# Altium schematic sheet Sheet2.SchDoc
size A4; SheetNumber: 1; SheetTotal: 1
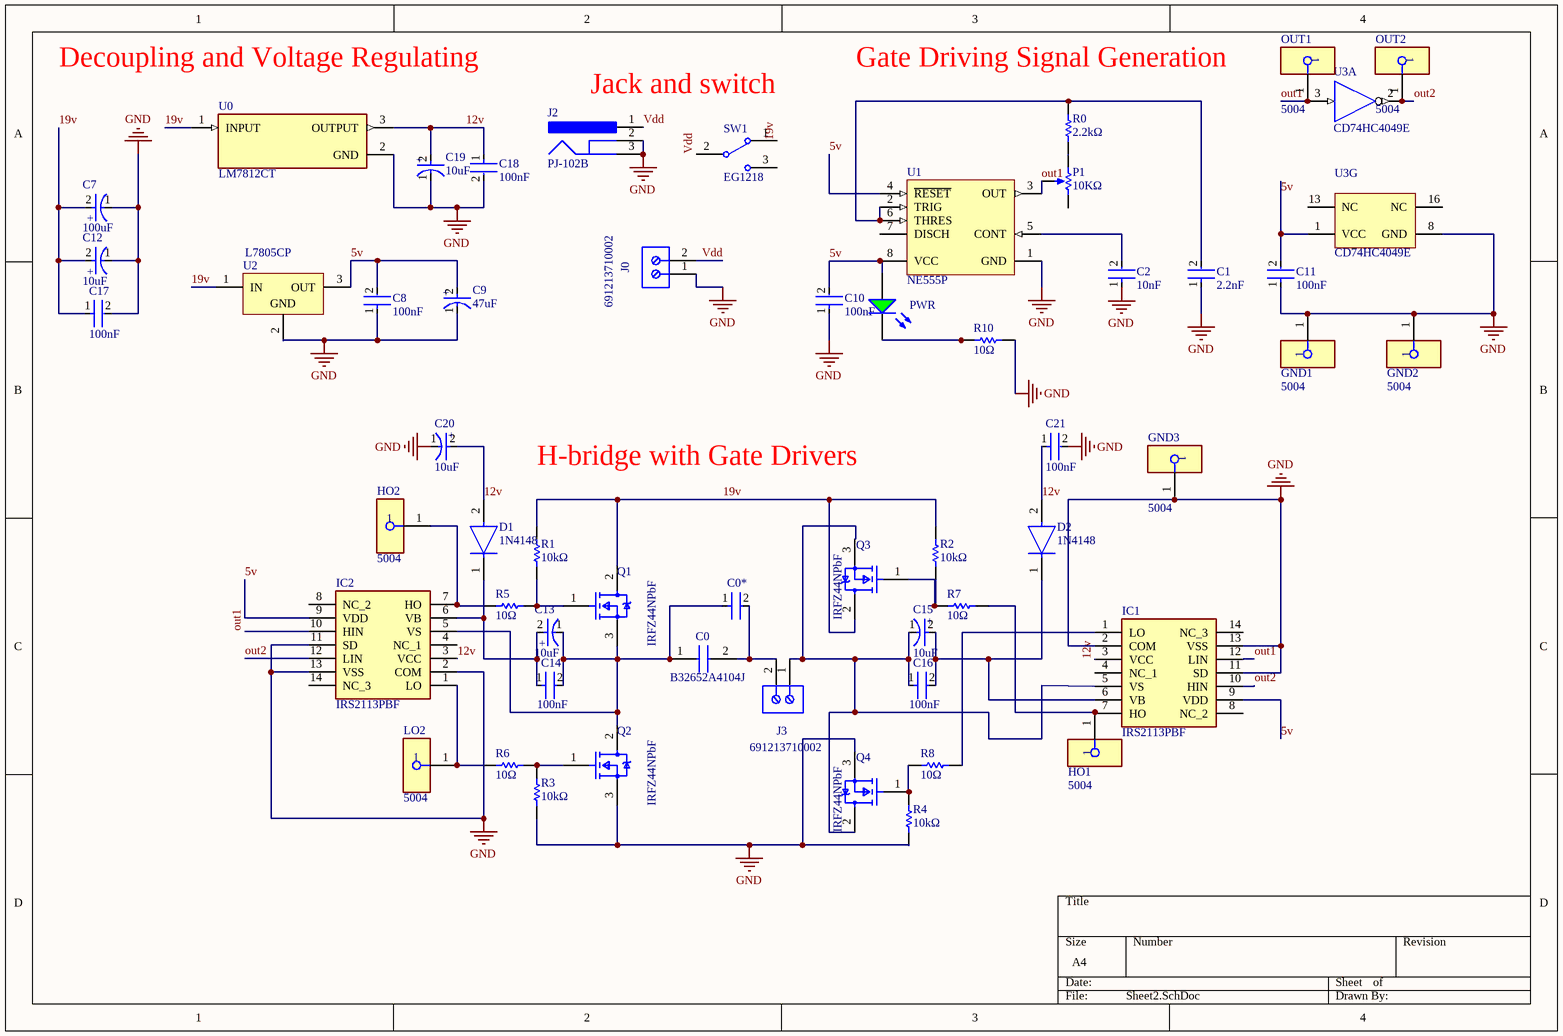
[diagram p0: Sheet2.SchDoc]

## Parts
C0  B32652A4104J  [B32652A4104J]
C0*  200nF  [FP-RDE2M1-MFG]  (value not drawn)
C1  2.2nF  [FP-RDE2M1-MFG]
C2  10nF  [FP-RDE2M1-MFG]
C7  100uF  [FP-RAD-TH-D_10_0_5-L_20_2-MFG]
C8  100nF  [FP-RDE2M1-MFG]
C9  47uF  [FP-RAD-TH-D_5_0_5-L_11_1-MFG]
C10  100nF  [FP-RDE2M1-MFG]
C11  100nF  [FP-RDE2M1-MFG]
C12  10uF  [FP-RAD-TH-D_5_0_5-L_11_1-MFG]
C13  10uF  [FP-RAD-TH-D_5_0_5-L_11_1-MFG]
C14  100nF  [FP-RDE2M1-MFG]
C15  10uF  [FP-RAD-TH-D_5_0_5-L_11_1-MFG]
C16  100nF  [FP-RDE2M1-MFG]
C17  100nF  [FP-RDE2M1-MFG]
C18  100nF  [FP-RDE2M1-MFG]
C19  10uF  [FP-RAD-TH-D_5_0_5-L_11_1-MFG]
C20  10uF  [FP-RAD-TH-D_5_0_5-L_11_1-MFG]
C21  100nF  [FP-RDE2M1-MFG]
D1  1N4148  [FP-017AG-MFG]
D2  1N4148  [FP-017AG-MFG]
GND1  5004  [FP-5004-MFG]
GND2  5004  [FP-5004-MFG]
GND3  5004  [FP-5004-MFG]
HO1  5004  [FP-5004-MFG]
HO2  5004  [FP-5004-MFG]
IC1  IRS2113PBF  [DIP762W56P254L1930H533Q14N]
IC2  IRS2113PBF  [DIP762W56P254L1930H533Q14N]
J0  691213710002  [691213710002]
J2  PJ-102B  [CUI-PJ-102B_V]
J3  691213710002  [691213710002]
LO2  5004  [FP-5004-MFG]
OUT1  5004  [FP-5004-MFG]
OUT2  5004  [FP-5004-MFG]
P1  10KΩ  [BOUR-3362P]
PWR  DS1  [AVAG-HLMP-4740]  (value not drawn)
Q1  IRFZ44NPbF  [FP-PG-TO220-3-MFG]
Q2  IRFZ44NPbF  [FP-PG-TO220-3-MFG]
Q3  IRFZ44NPbF  [FP-PG-TO220-3-MFG]
Q4  IRFZ44NPbF  [FP-PG-TO220-3-MFG]
R0  value 2.2kΩ  [AXIAL-0.3]
R1  value 10kΩ  [AXIAL-0.3]
R2  value 10kΩ  [AXIAL-0.3]
R3  value 10kΩ  [AXIAL-0.3]
R4  value 10kΩ  [AXIAL-0.3]
R5  value 10Ω  [AXIAL-0.3]
R6  value 10Ω  [AXIAL-0.3]
R7  value 10Ω  [AXIAL-0.3]
R8  value 10Ω  [AXIAL-0.3]
R10  value 10Ω  [AXIAL-0.3]
SW1  EG1218  [ESWI-EG1218_V]
U0  LM7812CT  [FP-TO220B03-MFG]
U1  NE555P  [P0008A]
U2  L7805CP  [TO220FP]
U3  CD74HC4049E  [N0016A]  (parts A,G of 7)

## Nets
GND: C1.1 C2.1 C7.1(C) C8.1 C9.1(C) C10.1 C11.1 C12.1(C) C17.2 C18.2 C19.1(C) C20.1(C) C21.2 GND1.1 GND2.1 GND3.1 IC1.2(COM) IC1.11(SD) IC1.13(VSS) IC2.2(COM) IC2.11(SD) IC2.13(VSS) J0.1 J2.2 J2.3 Q2.3(S) Q4.3(S) R3.2 R4.2 R10.1 U0.2(GND) U1.1(GND) U2.2(GND) U3.8(GND)
5v: C8.2 C9.2(A) C10.2 C11.2 IC1.9(VDD) IC2.9(VDD) PWR.1(A) U1.4(~{RESET}) U1.8(VCC) U2.3(OUT) U3.1(VCC)
12v: C18.1 C19.2(A) C20.2(A) C21.1 D1.2(A) D2.2(A) IC1.3(VCC) IC2.3(VCC) U0.3(OUTPUT)
19v: C7.2(A) C12.2(A) C17.1 Q1.2(D) Q3.2(D) R1.1 R2.1 SW1.1 U0.1(INPUT) U2.1(IN)
out1: IC1.12(LIN) IC2.10(HIN) OUT1.1 P1.2(S) U1.3(OUT) U3.3(1A)
out2: IC1.10(HIN) IC2.12(LIN) OUT2.1 U3.2(~{1Y})
Vdd: J0.2 J2.1 SW1.2(COM)
NetC0_1: C0.1 C0*.1 C13.1(C) C14.2 IC2.5(VS) Q1.3(S) Q2.2(D)
NetC0_2: C0.2 C0*.2 J3.2
NetC1_2: C1.2 R0.1 U1.2(TRIG) U1.6(THRES)
NetC2_2: C2.2 U1.5(CONT)
NetC13_2: C13.2(A) C14.1 D1.1(C) IC2.6(VB)
NetC15_1: C15.1(C) C16.1 IC1.5(VS) J3.1 Q3.3(S) Q4.2(D)
NetC15_2: C15.2(A) C16.2 D2.1(C) IC1.6(VB)
NetHO1_1: HO1.1 IC1.7(HO) R7.1
NetHO2_1: HO2.1 IC2.7(HO) R5.2
NetIC1_1: IC1.1(LO) R8.1
NetIC2_1: IC2.1(LO) LO2.1 R6.2
NetP1_1: P1.1(CCW) R0.2
NetPWR_2: PWR.2(K) R10.2
NetQ1_1: Q1.1(G) R1.2 R5.1
NetQ2_1: Q2.1(G) R3.1 R6.1
NetQ3_1: Q3.1(G) R2.2 R7.2
NetQ4_1: Q4.1(G) R4.1 R8.2

Not connected (* = marked no-connect by the designer): IC1 4(NC_1) 8(NC_2) 14(NC_3); IC2 4(NC_1) 8(NC_2) 14(NC_3); P1 3(CW); SW1 3; U1 7(DISCH); U3 13(NC) 16(NC)

## Notes on the sheet
- (near U0) Decoupling and Voltage Regulating
- Jack and switch
- (near OUT1) Gate Driving Signal Generation
- H-bridge with Gate Drivers
- (in symbol CMP-05427-000747-1) +
- (in symbol CMP-05427-001174-1) +

## Library data of the parts
C0 = B32652A4104J: Capacitor; Manufacturer_Name: TDK; Datasheet Link: https://componentsearchengine.com/Datasheets/1/B32652A4104J.pdf; Height: 10.5mm; Manufacturer_Part_Number: B32652A4104J; Mouser Part Number: 871-B32652A4104J; Mouser Price/Stock: https://www.mouser.co.uk/ProductDetail/EPCOS-TDK/B32652A4104J?qs=TAh7utZnAiWqtdyKMJwPOA%3D%3D; Arrow Part Number: B32652A4104J; Arrow Price/Stock: https://www.arrow.com/en/products/b32652a4104j/epcos-tdk
C0* C1 C2 C8 C10 C11 C14 C16-C18 C21 = CMP-06035-028300-1: Ceramic Capacitor 10nF ±10% 630V X7R Radial; Lead Diameter: 0.5mm; Lead/Base Style: Formed Leads; Width: 4mm; Resistor Type: Ceramic; Lead Free: Lead Free; Case/Package: Radial; Voltage Rating: 630V; Dielectric: X7R; Mount: Through Hole; Capacitance: 10nF; Voltage Rating (DC): 630V; Length: 0.217inch; Max Operating Temperature: 125°C; Min Operating Temperature: -55°C; Packaging: Tape and Reel; Height: 4mm; Package Quantity: 2000; Termination: Radial; Lead Pitch: 0.197inch; Tolerance: 10%; Height - Seated (Max): 0.236inch
C7 = CMP-05427-000747-1: Aluminum Electrolytic Capacitors (Radial Lead Type) AEC-Q200 Qualified 56uF ±20% 100V; Leakage Current: 3uA; Impedance: 240mR; Polarity: Polar; Lead Diameter: 0.6mm; Life (Hours): 3000Hour; Ripple Current: 463mA; Diameter: 10mm; Max Operating Temperature: 105°C; Packaging: Bulk; Min Operating Temperature: -55°C; Voltage: 100V; Mount: Through Hole; Voltage Rating (DC): 100V; Voltage Rating: 100V; Capacitance: 56uF; Radiation Hardening: No; Length: 20mm; Package Quantity: 200; Construction: RADIAL; Height: 20mm; Contact Plating: Tin; Lead Pitch: 5mm; Case/Package: Radial; RoHS Compliant: Yes; Height - Seated (Max): 0.866inch; Tolerance: 20%; Series: FC; Termination: Radial; ESR (Equivalent Series Resistance): 240mR
C9 C12 C13 C15 C19 C20 = CMP-05427-001174-1: Aluminum Electrolytic Capacitors (Radial Lead Type) AEC-Q200 Qualified 2.2uF ±20% 100V; Lead Diameter: 0.5mm; Life (Hours): 1000Hour; Lead/Base Style: Straight; Ripple Current: 21mA; Mount: Through Hole; Max Operating Temperature: 105°C; Length: 11mm; Voltage Rating (DC): 100V; Case/Package: Radial; Package Quantity: 2000; Lead Pitch: 2.5mm; Series: NHG; Min Operating Temperature: -55°C; Tolerance: 20%; Capacitance: 2.2uF; RoHS Compliant: Yes; Termination: Radial; Packaging: Ammo Pack; Height: 11mm; Diameter: 5mm; Radiation Hardening: No
D1 D2 = CMP-07163-000046-1: DIODE GEN PURP 100V 200MA DO35; Forward Voltage: 1V; Max Power Dissipation: 500mW; Max Reverse Current: 5uA; Forward Current: 300mA; Current: 4A; Reverse Recovery Time: 4ns; Element Configuration: Single; Outside Diameter: 1.85mm; Capacitance: 4pF; Polarity: Standard; Max Forward Surge Current (Ifsm): 1A; Reverse Voltage: 100V; Output Current: 200mA; Average Rectified Current: 200mA; Diameter: 1.91mm; Max Repetitive Reverse Voltage (Vrrm): 100V; Current Rating: 200mA; Case/Package: DO-35; Lead Free: Lead Free; Number of Pins: 2; Recovery Time: 4ns; Packaging: Bulk; Contact Plating: Tin; Voltage: 100V; Mount: Through Hole; Max Surge Current: 4A; Package Quantity: 2000; Width: 1.91mm; Max Reverse Voltage (DC): 100V; Length: 4.56mm; Radiation Hardening: No; Power Dissipation: 500mW; Voltage Rating (DC): 100V; Peak Non-Repetitive Surge Current: 4A; REACH SVHC: No SVHC; Height: 4.56mm; Max Operating Temperature: 175°C; Series: -; Weight: 0.01lb; Min Operating Temperature: -65°C
GND1-GND3 HO1 HO2 LO2 OUT1 OUT2 = CMP-2000-05575-2: PC TEST POINT MINIATURE YELLOW; Manufacturer: Keystone; Number Of Contacts: 1; Is Female: yes; Device Class L1: Connectors; Manufacturer Part Number: 5004; Digikey Description: PC TEST POINT MINIATURE YELLOW; ComponentLink2URL: https://www.keyelco.com/product-pdf.cfm?p=1313; Lead Free: Yes; ComponentLink2Description: Datasheet; Category: Conn; Height: 4.72mm; Octopart: https://octopart.com/5004-keystone-28591; Mouser Description: TEST POINT PC MINI .040"D YELLOW; Device Class L3: unset; Contact Material: Silver; Package: 5004; Automotive: No; Device Class L2: unset; RoHS: TRUE
IC1 IC2 = IRS2113PBF: Integrated Circuit; Manufacturer_Name: Infineon; Datasheet Link: https://www.infineon.com/cms/en/product/power/gate-driver-ics/?; Height: 5.33mm; Manufacturer_Part_Number: IRS2113PBF; Mouser Part Number: 942-IRS2113PBF; Mouser Price/Stock: https://www.mouser.co.uk/ProductDetail/Infineon-IR/IRS2113PBF?qs=9%252BKlkBgLFf1pf%2FQw3CtmfQ%3D%3D; Arrow Part Number: IRS2113PBF; Arrow Price/Stock: https://www.arrow.com/en/products/irs2113pbf/infineon-technologies-ag?region=nac
J0 J3 = CMP-1502-02526-3: 213 Series 5MM Pitch Straight, Pcb Terminal Block, Through Hole, 2 Way; Voltage: 300V; Number of Positions Per Level: 2; Pitch: 5.0038mm; Current: 10A; Plating: Brass, Steel; Wire Gauge (Min): 16AWG; Wire Gauge (Max): 26AWG; Stripping Length: -7mm; Number of Levels: 1; RoHS: Compliant; Contact Plating: Tin; Height: 10mm; Contact Material: Brass; Width: 10.6mm; Packaging: Box; Housing Material: Nylon; Mount: Through Hole; Max Operating Temperature: 105°C; Color: Green; Lead Pitch: 5mm; Voltage Rating: 300V; Min Operating Temperature: -40°C; Current Rating: 10A; Termination: Screw; Number of Pins: 2; Number of Contacts: 2; Length: 8.3mm; Wire/Cable Gauge: 26AWG
J2 = CMP-2000-06900-1: Through Hole Right Angle DC Power Jack, 2.5 A, 2.5 mm Center Pin, 3 Position, -25 to 85 degC, RoHS, Bulk; Manufacturer: CUIInc.; Insulation Resistance: 100MOhms; Inside Contact Diameter: 2.5mm; Outside Contact Diameter: 6.5mm; Voltage Rating: 24V; Current Rating: 2.5A; Brand: CUI; Datasheet URL: http://www.cui.com/product/resource/pj-102b.pdf; Housing Material: PolybutyleneTerephthalate(PBT); Operating Temperature Range: -25Cto+85C; Package Reference: PJ-102B; Factory Pack Quantity: 280; RoHS: True; Contact Material: Copper; Datasheet Version: Rev. 1.03, 04/2016; Product: Jacks; Mounting Angle: Right; Mounting Style: ThroughHole; Flammability Rating: UL94V-0; Product Category: DCPowerConnectors; Contact Gender: Male; Termination Style: ThroughHole; Manufacturer URL: http://www.cui.com/; Mounting Technology: ThroughHole; Package Description: 3-Pin Through Hole Device, Body 14.4 x 9 mm, Height 11 mm; Contact Plating: Nickel; Packaging: Bulk; Connector Type: DCPowerJack
P1 = CMP-1747-00003-1: Square Trimpot(R) Trimming Potentiometer, 100 KOhm, 300 V, -55 to 125 degC, 3-Pin THD, RoHS, Tube; Voltage Rating: 250 V; Case\Package: Axial; Tolerance: 1%; Power Rating: 250 mW; Resistance: 1 mohm; RoHSCompliant: true; ComponentLink2URL: http://www.bourns.com/docs/Product-Datasheets/3362.pdf; ComponentLink1Description: Manufacturer URL; DatasheetVersion: May-16; Package Quantity: 200; ComponentLink2Description: Datasheet; Min Operating Temperature: -55 degC; Mount: Through Hole; PackageDescription: 3-Pin Through Hole Device, Body 6.6 x 6.99 mm, Pitch 2.54 mm; Length: 0.248 inch; ComponentLink1URL: http://www.bourns.com/; PackageReference: 3326P; Max Operating Temperature: 155 degC; Packaging: Bulk
PWR = CMP-2000-06413-1: T-1 3/4 (5 mm) Low Current LED Lamp, Green, 1.9 V, -20 to 100 degC, 2-Pin THD, RoHS, Bulk; Manufacturer: AvagoTechnologies; Peak Wavelength: 565nm; Rad Hard: No; Viewing Angle: 50°; Dominant Wavelength/Color Temperature: 569nm; Number of LEDs: 1; Lens Appearance: ColoredDiffused; Lens Shape Type: Circular; Mounting Orientation: TopMount; Intensity: 2.3mcd; Datasheet Version: 07/2014; Category: LEDs; Datasheet URL: http://docs.avagotech.com/docs/AV02-1557EN; Packaging: Bulk; Pin Count: 2; Mounting Technology: ThroughHole; Package Reference: HLMP-4740; Mounting: ThroughHole; Type: Uni-Color; Manufacturer URL: http://www.avagotech.com/; Color: Green; Package: 2T-13/4; Package Description: 2-Pin Through Hole Device, Dia 5.845 mm, Pitch 2.54 mm
Q1-Q4 = CMP-32901-000488-1: MOSFET N-CH 55V 47A TO220AB; Turn-On Delay Time: 11ns; Gate to Source Voltage (Vgs): 16V; Element Configuration: Single; Rds On Max: 22mR; Turn-Off Delay Time: 26ns; Max Power Dissipation: 110W; Threshold Voltage: 2V; Drain to Source Resistance: 35mR; Input Capacitance: 1.7nF; Continuous Drain Current (ID): 47A; Case/Package: TO-220; Lead Free: Lead Free; Halogen Free: Halogen Free; Packaging: Rail/Tube; Length: 0.414inch; Min Operating Temperature: -55°C; REACH SVHC: No SVHC; Number of Pins: 3; Width: 0.185inch; Drain to Source Voltage (Vdss): 55V; Power Dissipation: 110W; RoHS Compliant: Yes; Max Operating Temperature: 175°C; Height: 0.6inch; Max Dual Supply Voltage: 55V; Drain to Source Breakdown Voltage: 55V; Mount: Through Hole
R0-R8 R10 = Res1: Resistor; Published: 8-Jun-2000; LatestRevisionDate: 17-Jul-2002; LatestRevisionNote: Re-released for DXP Platform.; PackageReference: AXIAL-0.3; Publisher: Altium Limited; PackageDescription: Axial Device, Thru-Hole; 2 Leads; 0.3 in Pin Spacing
SW1 = CMP-1696-00002-1: Slide Switch, 500 V, -20 to 70 degC, 3-Pin THD, RoHS; Case\Package: SOT-23-5; Output Current: 150 mA; Nominal Output Voltage: 3.3 V; Max Power Dissipation: 250 mW; Min Input Voltage: 4.3 V; Outputs: 1; Max Input Voltage: 8 V; Dropout Voltage: 300 mV; PackageDescription: 3-Pin Through Hole Device, Body 11.6 x 4 mm, Pitch 2.5 mm; ComponentLink1URL: http://www.e-switch.ch/en/; RoHSCompliant: true; Length: 3 mm; ComponentLink1Description: Manufacturer URL; Power Rating: 250 mW; Mount: Surface Mount; Max Operating Temperature: 85 degC; REACH SVHC: No SVHC; Radiation Hardening: No; Height: 1.3 mm; Pins: 5; Max Ouput Current: 150 mA; Output Voltage: 3.3 V; Width: 1.8 mm; Package Quantity: 3000; ComponentLink2URL: https://www.e-switch.com/system/asset/product_line/data_sheet/119/EG.pdf; Min Operating Temperature: -40 degC; ComponentLink2Description: Datasheet; DatasheetVersion: Oct-15; PackageReference: EG1218; Packaging: Tape and Reel
U0 = CMP-07128-000015-1: IC REG LINEAR 12V 1A TO220-3; Obsolete Part: true; Manufacturer: ON Semiconductor; Nominal Supply Current: 5.1mA; Output Type: Fixed; Dropout Voltage: 2V; Max Supply Voltage: 35V; Accuracy Percentage: 4%; Standoff Height: 2.7mm; Number Of Outputs: 1; Octopart: https://octopart.com/lm7812ct-on+semiconductor-14383031; Output Current: 1A; ComponentLink2Description: Datasheet; Device Class L1: Integrated Circuits (ICs); Device Class L2: Power Management ICs; Temperature Range Low: -40°C; Category: IC; Package: TO220B03; Device Class L3: Voltage Regulators - Linear; RoHS: TRUE; Digikey Description: IC REG LINEAR 12V 1A TO220-3; Ipc Land Pattern Name: TO-220; Output Voltage: 12V; Temperature: -40°C to +125°C; Automotive: No; Temperature Range High: +125°C; ComponentLink2URL: https://www.mouser.in/datasheet/2/308/LM7812-1125088.pdf; Manufacturer Part Number: LM7812CT; Height: 20.4mm; Lead Free: Yes
U1 = CMP-2000-04954-1: Precision Timer, 4.5 to 16 V, 0 to 70 degC, 8-Pin DIP, Pb-Free, Tube; Manufacturer: TexasInstruments; Maximum High Level Output Current: -200mA; Number of Internal Timers: 1; Operating Supply Voltage: 5; Maximum Low Level Output Current: 200mA; Rad Hard: No; Packaging: Rail/Tube; Manufacturer URL: http://www.ti.com/; Package Reference: P8; Package Description: 8-Pin Double In-line Package, Body 9.59 x 6.35 mm, Pitch 2.54 mm; Package URL: http://www.ti.com/lit/ml/mpdi001b/mpdi001b.pdf; Type: Standard; Datasheet URL: http://www.ti.com/general/docs/lit/getliterature.tsp?genericPartNumber=NE555&fileType=pdf; Category: Timer; Package: 8PDIP; Datasheet Version: Rev. I, 09/2014
U2 = CMP-0244-00474-1: Positive Voltage Regulator, 5V, 3-Pin TO-220FP; ComponentLink1Description: Manufacturer URL; ComponentLink2Description: Datasheet; DatasheetVersion: 16/11/2011; PackageDescription: TO, Thru-Hole, Vertical, Heatsink Mounted; 3 In-Line Leads; Pitch 2.54 mm; ComponentLink2URL: http://www.st.com/internet/com/TECHNICAL_RESOURCES/TECHNICAL_LITERATURE/DATASHEET/CD00000444.pdf; ComponentLink1URL: http://www.st.com; PackageVersion: 2011; PackageReference: TO220FP
U3 = CMP-1615-00917-2: High Speed CMOS Logic Hex Inverting Buffers, N0016A, TUBE; Manufacturer: Texas Instruments; VCC(Max)(V): 6; Output Drive (IOL/IOH)(Max)(mA): -4/4; tpd @ Nom Voltage(Max)(ns): 18; F @ Nom Voltage(Max)(Mhz): 28; Rating: Catalog; Technology Family: HC; VCC(Min)(V): 2; Schmitt Trigger: No; ICC @ Nom Voltage(Max)(mA): 0.02; DatasheetVersion: SCHS205I; Operating Temperature Range(C): -55 to 125; Output Type: CMOS; Bits(#): 6; Input Type: CMOS; Voltage(Nom)(V): 6; PackageReference: N0016A; Generic Part Number: CD74HC4049; Code_JEDEC: MS-001